# EAGLE schematic kingoftone_v1 (EAGLE 6.4)
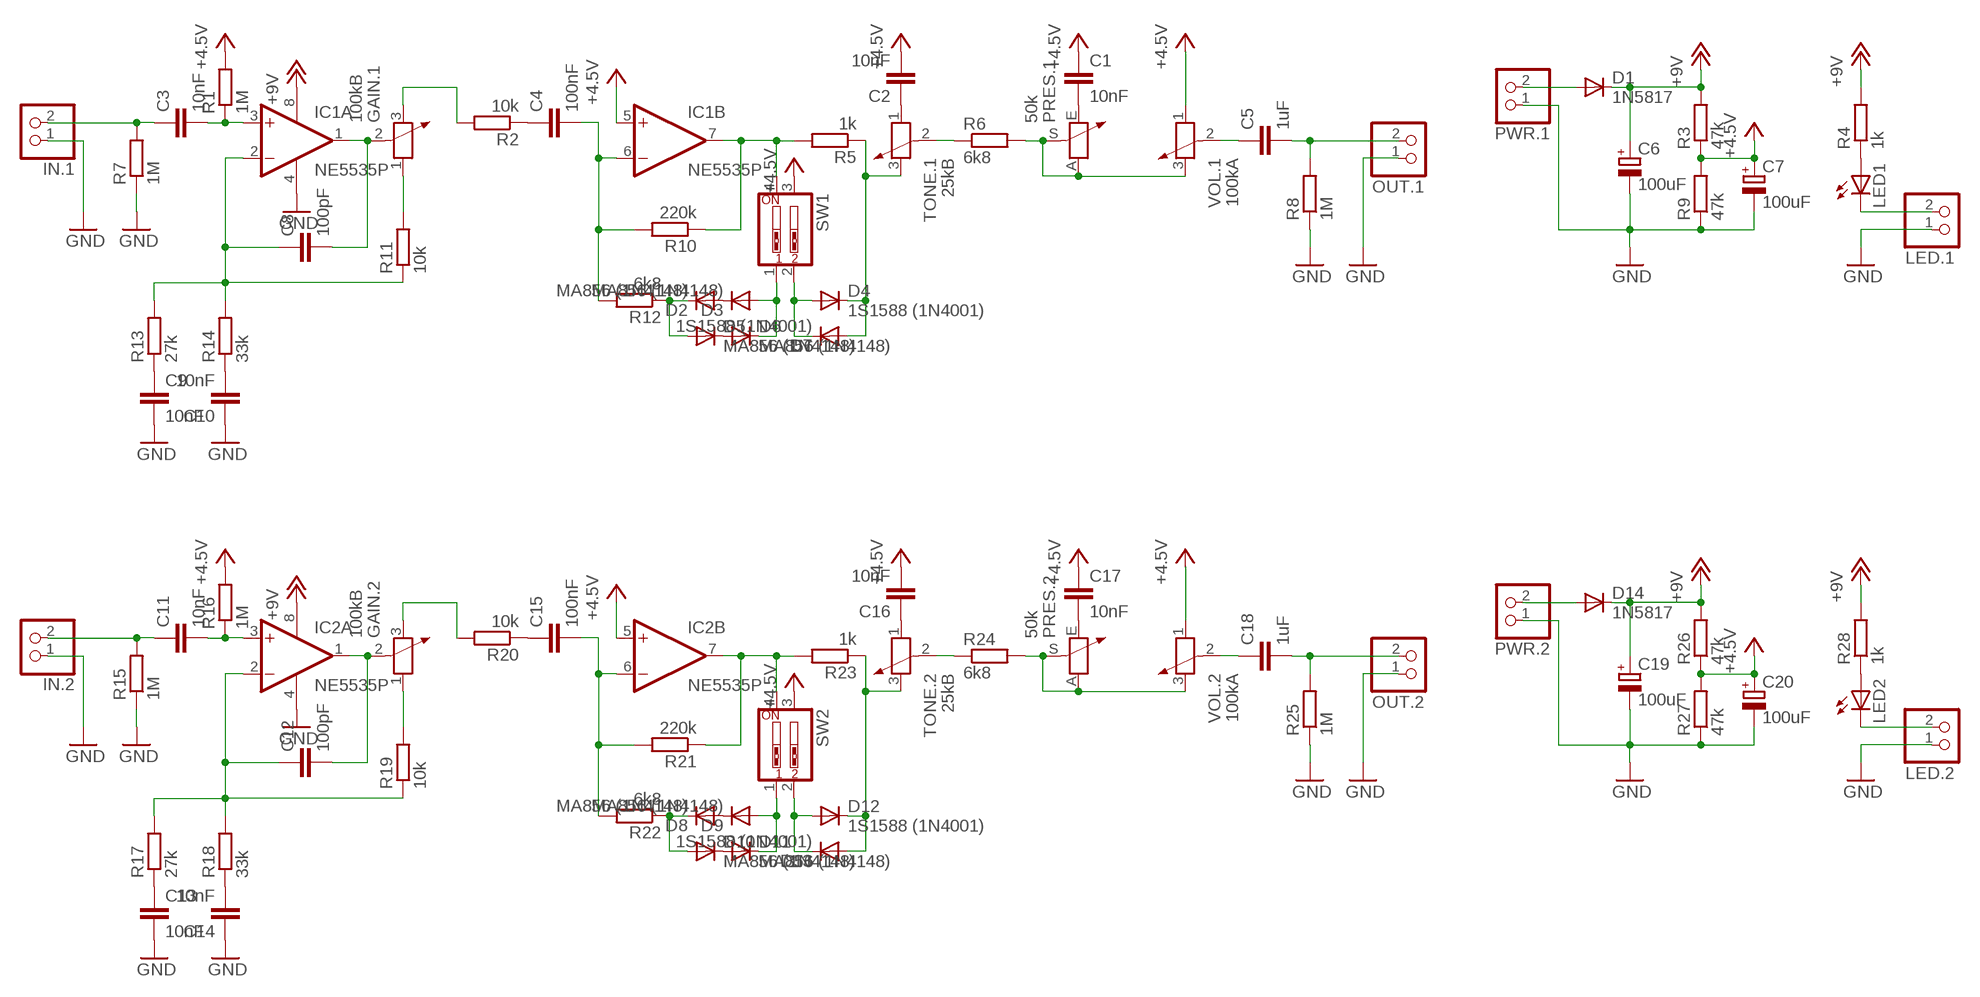
[diagram p0: schematic, sheet 1]

## Parts
C1  10nF  C-EU050-025X075  [C050-025X075]
C2  10nF  C-EU050-025X075  [C050-025X075]
C3  10nF  C-EU050-025X075  [C050-025X075]
C4  100nF  C-EU050-025X075  [C050-025X075]
C5  1uF  C-EU050-025X075  [C050-025X075]
C6  100uF  CPOL-EUE2.5-6  [E2,5-6]
C7  100uF  CPOL-EUE2.5-6  [E2,5-6]
C8  100pF  C-EU050-025X075  [C050-025X075]
C9  10nF  C-EU050-025X075  [C050-025X075]
C10  10nF  C-EU050-025X075  [C050-025X075]
C11  10nF  C-EU050-025X075  [C050-025X075]
C12  100pF  C-EU050-025X075  [C050-025X075]
C13  10nF  C-EU050-025X075  [C050-025X075]
C14  10nF  C-EU050-025X075  [C050-025X075]
C15  100nF  C-EU050-025X075  [C050-025X075]
C16  10nF  C-EU050-025X075  [C050-025X075]
C17  10nF  C-EU050-025X075  [C050-025X075]
C18  1uF  C-EU050-025X075  [C050-025X075]
C19  100uF  CPOL-EUE2.5-6  [E2,5-6]
C20  100uF  CPOL-EUE2.5-6  [E2,5-6]
D1  1N5817  1N4004C  [DO41-5]
D2  MA856 (1N4148)  1N4004C  [DO41-5]
D3  MA856 (1N4148)  1N4004C  [DO41-5]
D4  1S1588 (1N4001)  1N4004C  [DO41-5]
D5  MA856 (1N4148)  1N4004C  [DO41-5]
D6  MA856 (1N4148)  1N4004C  [DO41-5]
D7  1S1588 (1N4001)  1N4004C  [DO41-5]
D8  MA856 (1N4148)  1N4004C  [DO41-5]
D9  MA856 (1N4148)  1N4004C  [DO41-5]
D10  MA856 (1N4148)  1N4004C  [DO41-5]
D11  MA856 (1N4148)  1N4004C  [DO41-5]
D12  1S1588 (1N4001)  1N4004C  [DO41-5]
D13  1S1588 (1N4001)  1N4004C  [DO41-5]
D14  1N5817  1N4004C  [DO41-5]
GAIN.1  100kB  POTENTIOMETER_  [1X03]
GAIN.2  100kB  POTENTIOMETER_  [1X03]
IC1  NE5535P  [DIL08]
IC2  NE5535P  [DIL08]
IN.1  PINHD-1X2  [1X02]
IN.2  PINHD-1X2  [1X02]
LED1  LED3MM  [LED3MM]
LED2  LED3MM  [LED3MM]
LED.1  PINHD-1X2  [1X02]
LED.2  PINHD-1X2  [1X02]
OUT.1  PINHD-1X2  [1X02]
OUT.2  PINHD-1X2  [1X02]
PRES.1  50k  POTENTIOMETER_CT6  [CT6]
PRES.2  50k  POTENTIOMETER_CT6  [CT6]
PWR.1  PINHD-1X2  [1X02]
PWR.2  PINHD-1X2  [1X02]
R1  1M  R-EU_0207/5V  [0207/5V]
R2  10k  R-EU_0207/5V  [0207/5V]
R3  47k  R-EU_0207/5V  [0207/5V]
R4  1k  R-EU_0207/5V  [0207/5V]
R5  1k  R-EU_0207/5V  [0207/5V]
R6  6k8  R-EU_0207/5V  [0207/5V]
R7  1M  R-EU_0207/5V  [0207/5V]
R8  1M  R-EU_0207/5V  [0207/5V]
R9  47k  R-EU_0207/5V  [0207/5V]
R10  220k  R-EU_0207/5V  [0207/5V]
R11  10k  R-EU_0207/5V  [0207/5V]
R12  6k8  R-EU_0207/5V  [0207/5V]
R13  27k  R-EU_0207/5V  [0207/5V]
R14  33k  R-EU_0207/5V  [0207/5V]
R15  1M  R-EU_0207/5V  [0207/5V]
R16  1M  R-EU_0207/5V  [0207/5V]
R17  27k  R-EU_0207/5V  [0207/5V]
R18  33k  R-EU_0207/5V  [0207/5V]
R19  10k  R-EU_0207/5V  [0207/5V]
R20  10k  R-EU_0207/5V  [0207/5V]
R21  220k  R-EU_0207/5V  [0207/5V]
R22  6k8  R-EU_0207/5V  [0207/5V]
R23  1k  R-EU_0207/5V  [0207/5V]
R24  6k8  R-EU_0207/5V  [0207/5V]
R25  1M  R-EU_0207/5V  [0207/5V]
R26  47k  R-EU_0207/5V  [0207/5V]
R27  47k  R-EU_0207/5V  [0207/5V]
R28  1k  R-EU_0207/5V  [0207/5V]
SW1  SW_DIP-2  [EDG-02]
SW2  SW_DIP-2  [EDG-02]
TONE.1  25kB  POTENTIOMETER_  [1X03]
TONE.2  25kB  POTENTIOMETER_  [1X03]
VOL.1  100kA  POTENTIOMETER_  [1X03]
VOL.2  100kA  POTENTIOMETER_  [1X03]

## Nets
+4.5V: C1.1 C2.2 C7.+ C16.2 C17.1 C20.+ IC1.5(B:+IN) IC2.5(B:+IN) R1.2 R3.1 R9.2 R16.2 R26.1 R27.2 SW1.3 SW2.3 VOL.1.1 VOL.2.1
+9V: C6.+ C19.+ D1.C D14.C IC1.8(A:V+) IC2.8(A:V+) R3.2 R4.2 R26.2 R28.2
GND: C6.- C7.- C9.2 C10.1 C13.2 C14.1 C19.- C20.- IC1.4(A:V-) IC2.4(A:V-) IN.1.1 IN.2.1 LED.1.1 LED.2.1 OUT.1.1 OUT.2.1 PWR.1.1 PWR.2.1 R7.1 R8.1 R9.1 R15.1 R25.1 R27.1
N$1: C3.1 IN.1.2 R7.2
N$2: C3.2 IC1.3(A:+IN) R1.1
N$3: C8.1 IC1.2(A:-IN) R11.1 R13.2 R14.2
N$4: C8.2 GAIN.1.2 IC1.1(A:OUT)
N$5: C9.1 R13.1
N$6: C10.2 R14.1
N$7: GAIN.1.1 R11.2
N$8: C4.1 R2.1
N$9: GAIN.1.3 R2.2
N$10: C4.2 IC1.6(B:-IN) R10.2 R12.2
N$11: IC1.7(B:OUT) R5.2 R10.1 SW1.4
N$12: D2.A D3.C
N$13: D2.C D5.A R12.1
N$14: D5.C D6.A
N$15: D3.A D6.C SW1.1
N$16: D4.C D7.A R5.1 TONE.1.3
N$17: D4.A D7.C SW1.2
N$18: C5.1 VOL.1.2
N$19: R6.1 TONE.1.2
N$20: C2.1 TONE.1.1
N$21: C1.2 PRES.1.E
N$22: PRES.1.A PRES.1.S R6.2 VOL.1.3
N$23: C5.2 OUT.1.2 R8.2
N$24: D1.A PWR.1.2
N$25: LED1.A R4.1
N$26: LED1.K(C) LED.1.2
N$27: C11.1 IN.2.2 R15.2
N$28: C11.2 IC2.3(A:+IN) R16.1
N$29: C12.1 IC2.2(A:-IN) R17.2 R18.2 R19.1
N$30: C12.2 GAIN.2.2 IC2.1(A:OUT)
N$31: C13.1 R17.1
N$32: C14.2 R18.1
N$33: GAIN.2.1 R19.2
N$34: C15.1 R20.1
N$35: GAIN.2.3 R20.2
N$36: C15.2 IC2.6(B:-IN) R21.2 R22.2
N$37: IC2.7(B:OUT) R21.1 R23.2 SW2.4
N$38: D8.A D9.C
N$39: D8.C D10.A R22.1
N$40: D10.C D11.A
N$41: D9.A D11.C SW2.1
N$42: D12.A D13.C SW2.2
N$43: R24.1 TONE.2.2
N$44: C16.1 TONE.2.1
N$45: C17.2 PRES.2.E
N$46: PRES.2.A PRES.2.S R24.2 VOL.2.3
N$47: D12.C D13.A R23.1 TONE.2.3
N$48: C18.1 VOL.2.2
N$49: C18.2 OUT.2.2 R25.2
N$50: D14.A PWR.2.2
N$51: LED2.A R28.1
N$52: LED2.K(C) LED.2.2

## Library data of the parts
C1-C5 C8-C18 = kingoftone:C-EU: CAPACITOR, European symbol
C6 C7 C19 C20 = kingoftone:CPOL-EU: POLARIZED CAPACITOR, European symbol
D1-D14 = kingoftone:1N4004: DIODE general purpose rectifier, 1 A
GAIN.1 GAIN.2 PRES.1 PRES.2 TONE.1 TONE.2 VOL.1 VOL.2 = kingoftone:POTENTIOMETER_: Potentiometer
IC1 IC2 = kingoftone:NE5535: Dual Operational Amplifier Low Power, Single-Supply, Rail-To-Rail Operational Amplifier Source: http://focus.ti.com/lit/ds/symlink/opa2345.pdf http://focus.ti.com .. opa241.pdf http://focus.ti.com/lit/ds/symlink/opa2134.pdf
IN.1 IN.2 LED.1 LED.2 OUT.1 OUT.2 PWR.1 PWR.2 = kingoftone:PINHD-1X2: PIN HEADER
LED1 LED2 = kingoftone:LED
R1-R28 = kingoftone:R-EU_: RESISTOR, European symbol
SW1 SW2 = kingoftone:SW_DIP-2: DIP SWITCH